# EAGLE design 12VSLA_UPS (EAGLE 6.4)
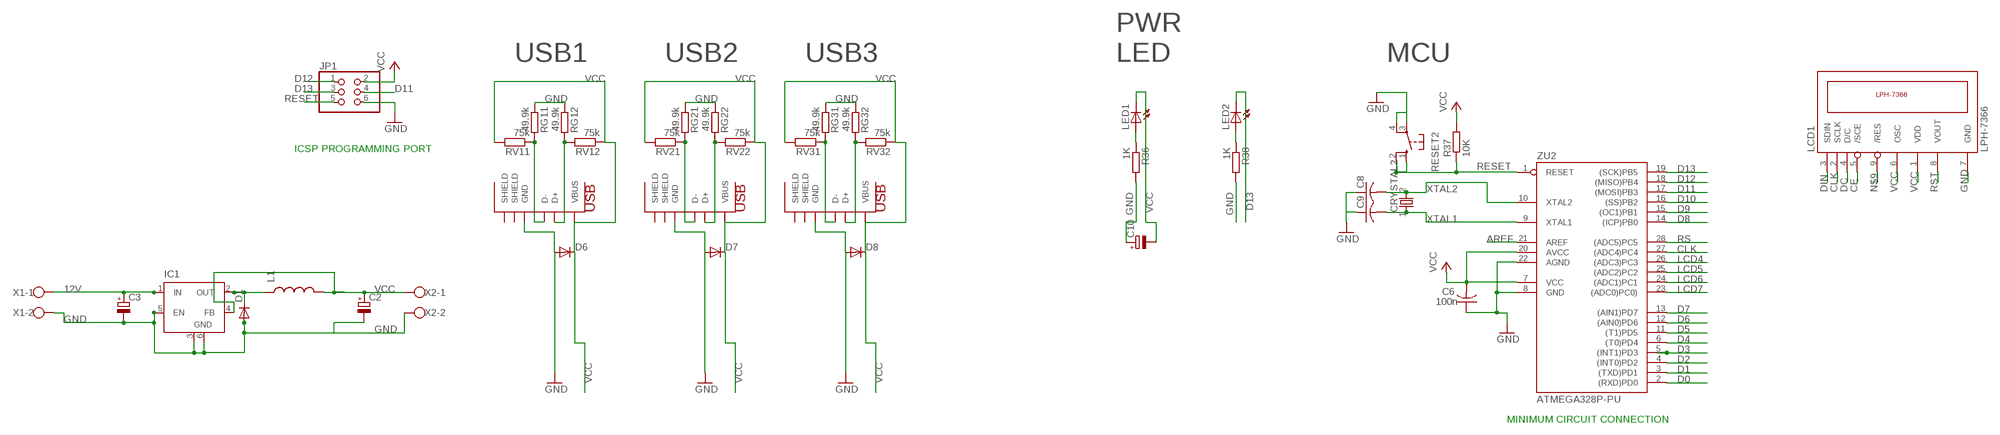
[diagram p0: schematic, sheet 1]

## Parts
C2  CPOL-EU153CLV-0605  [153CLV-0605]
C3  CPOL-EU153CLV-0605  [153CLV-0605]
C6  100n  C-USC1206K  [C1206K]
C8  C-USC1206K  [C1206K]
C9  C-USC1206K  [C1206K]
C10  CPOL-EU153CLV-0807  [153CLV-0807]
CRYSTAL2  CRYSTAL2PIN  [CRYSTAL-2PIN]
D1  DIODE-DO-214AC  [DO-214AC]
D6  DIODESMA-ALT  [SMA-DIODE_ALT]
D7  DIODESMA-ALT  [SMA-DIODE_ALT]
D8  DIODESMA-ALT  [SMA-DIODE_ALT]
IC1  LM2596S  [TO263-5]
JP1  PINHD-2X3  [2X03]
L1  INDUCTORPWR  [CDRH125]
LCD1  LPH-7366  [LPH-7366]
LED1  LED3MM  [LED3MM]
LED2  LED3MM  [LED3MM]
R36  1K  R-EU_M1206  [M1206]
R37  10K  R-EU_M1206  [M1206]
R38  1K  R-EU_M1206  [M1206]
RESET2  10-XX  [B3F-10XX]
RG11  49.9k  R-EU_M1206  [M1206]
RG12  49.9k  R-EU_M1206  [M1206]
RG21  49.9k  R-EU_M1206  [M1206]
RG22  49.9k  R-EU_M1206  [M1206]
RG31  49.9k  R-EU_M1206  [M1206]
RG32  49.9k  R-EU_M1206  [M1206]
RV11  75k  R-EU_M1206  [M1206]
RV12  75k  R-EU_M1206  [M1206]
RV21  75k  R-EU_M1206  [M1206]
RV22  75k  R-EU_M1206  [M1206]
RV31  75k  R-EU_M1206  [M1206]
RV32  75k  R-EU_M1206  [M1206]
USB1  USB-A-H  [USB-A-H]
USB2  USB-A-H  [USB-A-H]
USB3  USB-A-H  [USB-A-H]
X1  W237-102  [W237-102]
X2  W237-102  [W237-102]
ZU2  ATMEGA328P-PU  [DIL28-3]

## Nets
12V: C3.+ IC1.1(IN) X1.1
AREF [aref]: ZU2.21(AREF)
CE: LCD1.5(/SCE)
CLK: LCD1.2(SCLK) ZU2.27((ADC4)PC4)
D0: ZU2.2((RXD)PD0)
D1: ZU2.3((TXD)PD1)
D2: ZU2.4((INT0)PD2)
D3: ZU2.5((INT1)PD3)
D4: ZU2.6((T0)PD4)
D5: ZU2.11((T1)PD5)
D6: ZU2.12((AIN0)PD6)
D7: ZU2.13((AIN1)PD7)
D8: ZU2.14((ICP)PB0)
D9: ZU2.15((OC1)PB1)
D10: ZU2.16((SS)PB2)
D11: JP1.4 ZU2.17((MOSI)PB3)
D12: JP1.1 ZU2.18((MISO)PB4)
D13: JP1.3 LED2.K(C) ZU2.19((SCK)PB5)
D+4: RG12.2 RV12.2 USB1.D+
D+5: RG22.2 RV22.2 USB2.D+
D+6: RG32.2 RV32.2 USB3.D+
D-4: RG11.2 RV11.1 USB1.D-
D-5: RG21.2 RV21.1 USB2.D-
D-6: RG31.2 RV31.1 USB3.D-
DC: LCD1.4(D/C)
DIN: LCD1.3(SDIN)
GND: C2.- C3.- C6.1 C8.1 C9.1 C10.+ D1.2(A) D6.A D7.A D8.A IC1.3(GND) IC1.5(EN) IC1.6(GND) JP1.6 LCD1.7(GND) R36.2 R38.2 RESET2.3(P) RESET2.4(P1) RG11.1 RG12.1 RG21.1 RG22.1 RG31.1 RG32.1 USB1.GND USB2.GND USB3.GND X1.2 X2.2 ZU2.8(GND) ZU2.22(AGND)
LCD4: ZU2.26((ADC3)PC3)
LCD5: ZU2.25((ADC2)PC2)
LCD6: ZU2.24((ADC1)PC1)
LCD7: ZU2.23((ADC0)PC0))
N$1: D1.1(C) IC1.2(OUT) L1.1
N$2: LED1.A R36.1
N$3: LED2.A R38.1
N$9: LCD1.9(/RES)
RESET: JP1.5 R37.1 RESET2.1(S) RESET2.2(S1) ZU2.1(RESET)
RS: ZU2.28((ADC5)PC5)
RST: LCD1.8(VOUT)
VCC: C2.+ C6.2 C10.- D6.C D7.C D8.C IC1.4(FB) JP1.2 L1.2 LCD1.1(VDD) LCD1.6(OSC) LED1.K(C) R37.2 RV11.2 RV12.1 RV21.2 RV22.1 RV31.2 RV32.1 USB1.VBUS USB2.VBUS USB3.VBUS X2.1 ZU2.7(VCC) ZU2.20(AVCC)
XTAL1: C9.2 CRYSTAL2.1 ZU2.9(XTAL1)
XTAL2: C8.2 CRYSTAL2.2 ZU2.10(XTAL2)
Unconnected: USB1.GND@1(SHIELD) USB1.GND@2(SHIELD) USB2.GND@1(SHIELD) USB2.GND@2(SHIELD) USB3.GND@1(SHIELD) USB3.GND@2(SHIELD)

## Notes on the sheet
- USB1 | USB2 | USB3
- PWR
  LED
- MCU
- ICSP PROGRAMMING PORT
- MINIMUM CIRCUIT CONNECTION

## Library data of the parts
C2 C3 C10 = rcl:CPOL-EU: POLARIZED CAPACITOR, European symbol
C6 C8 C9 = adafruit:C-US: CAPACITOR, American symbol
CRYSTAL2 = BaseApp:CRYSTAL: CRYSTAL SMD-10.5X4.8-2PIN :- http://www.digikey.com/product-detail/en/CX49GFNB12000H0PESZZ/478-4349-1-ND/1532102 SMD-5X3- 4PIN :- 535-11281-1-ND
D1 = dp_devices:DIODE: Various Diode Packages
D6-D8 = SparkFun-DiscreteSemi:DIODE: Diode These are standard reverse protection diodes and small signal diodes. SMA package can handle up to about 1A. SOD-323 can handle about 200mA. What the SOD-323 package when ordering, there are some mfgs out there that are 5-pin packages.
IC1 = linear:LM2596S: STEP-DOWN VOLTAGE REGULATOR
JP1 = pinhead:PINHD-2X3: PIN HEADER
L1 = SparkFun-Passives:INDUCTOR: Inductors Basic Inductor/Choke - 0603 and 1206. Footprints are not proven and vary greatly between part numbers. SRN6045- 33uH, 20% 1.4A SDR0403-560KL - 56uH, 10%, 500mA RMS/740mA peak
LCD1 = lph-7366:LPH-7366
LED1 LED2 = adafruit:LED: LED OSRAM: - CHIPLED LG R971, LG N971, LY N971, LG Q971, LY Q971, LO R971, LY R971 LH N974, LH R974 LS Q976, LO Q976, LY Q976 LO Q996 - Hyper CHIPLED LW Q18S LB Q993, LB Q99A, LB R99A - SideLED LS A670, LO A670, LY A670, LG A670, LP A670 LB A673, LV A673, LT A673, LW A673 LH A674 LY A675 LS A676, LA A676, LO A676, LY A676, LW A676 LS A679, LY A679, LG A679 - Hyper Micro SIDELED® LS Y876, LA Y876, LO Y876, LY Y876 LT Y87S - SmartLED LW L88C, LW L88S LB L89C, LB L89S, LG L890 LS L89K, LO L89K, LY L89K LS L896, LA L896, LO L896, LY L896 - TOPLED LS T670, LO T670, LY T670, LG T670, LP T670 LSG T670, LSP T670, LSY T670, LOP T670, LYG T670 LG T671, LOG T671, LSG T671 LB T673, LV T673, LT T673, LW T673 LH T674 LS T676, LA T676, LO T676, LY T676, LB T676, LH T676, LSB T676, LW T676 LB T67C, LV T67C, LT T67C, LS T67K, LO T67K, LY T67K, LW E67C LS E67B, LA E67B, LO E67B, LY E67B, LB E67C, LV E67C, LT E67C LW T67C LS T679, LY T679, LG T679 LS T770, LO T770, LY T770, LG T770, LP T770 LB T773, LV T773, LT T773, LW T773 LH T774 LS E675, LA E675, LY E675, LS T675 LS T776, LA T776, LO T776, LY T776, LB T776 LHGB T686 LT T68C, LB T68C - Hyper Mini TOPLED® LB M676 - Mini TOPLED Santana® LG M470 LS M47K, LO M47K, LY M47K Source: http://www.osram.convergy.de/
R36 R38 RG11 RG12 RG21 RG22 RG31 RG32 RV11 RV12 RV21 RV22 RV31 RV32 = resistor:R-EU_: RESISTOR, European symbol
R37 = rcl:R-EU_: RESISTOR, European symbol
RESET2 = switch-omron:10-XX: OMRON SWITCH; MPN: B3F-1000; OC_FARNELL: 176432; OC_NEWARK: 36M3542
USB1-USB3 = BaseApp:USB
X1 X2 = con-wago-500:W237-102: WAGO SCREW CLAMP; MPN: 237-102; OC_FARNELL: unknown; OC_NEWARK: 70K9898
ZU2 = SmartPrj:ATMEGA328P-: MICROCONTROLLER 4 Kbytes FLASH 128 bytes SRAM 256 bytes EEPROM UART 6-channel 10 bit ADC

## Net classes
0 default: width 0.254 mm, clearance 0.254 mm
4 aref: width 0.406 mm, drill 0.61 mm, clearance 0.254 mm

## Board
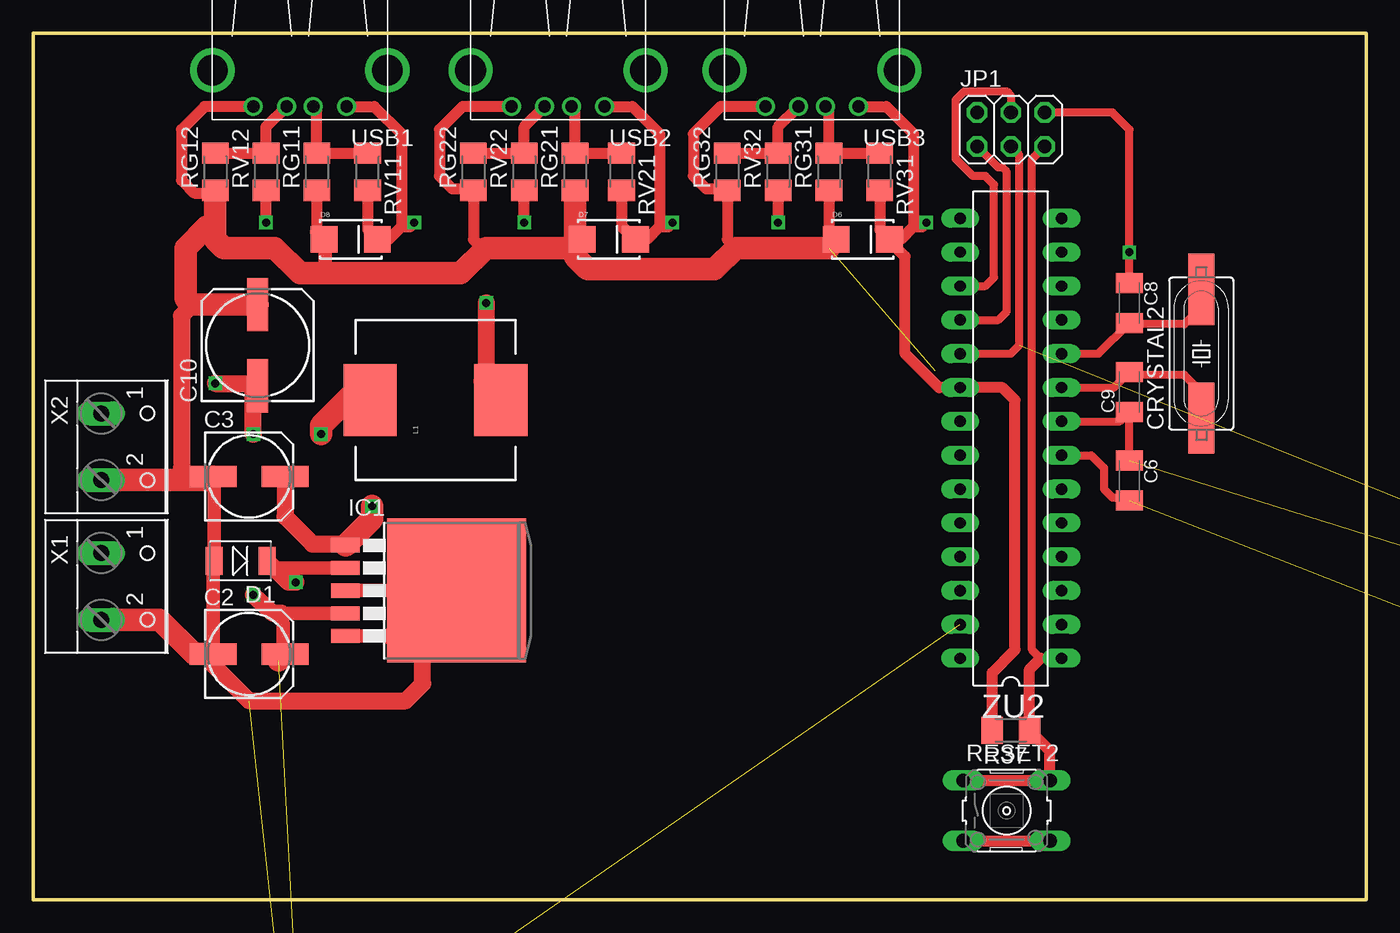
[diagram p1: board, top side]
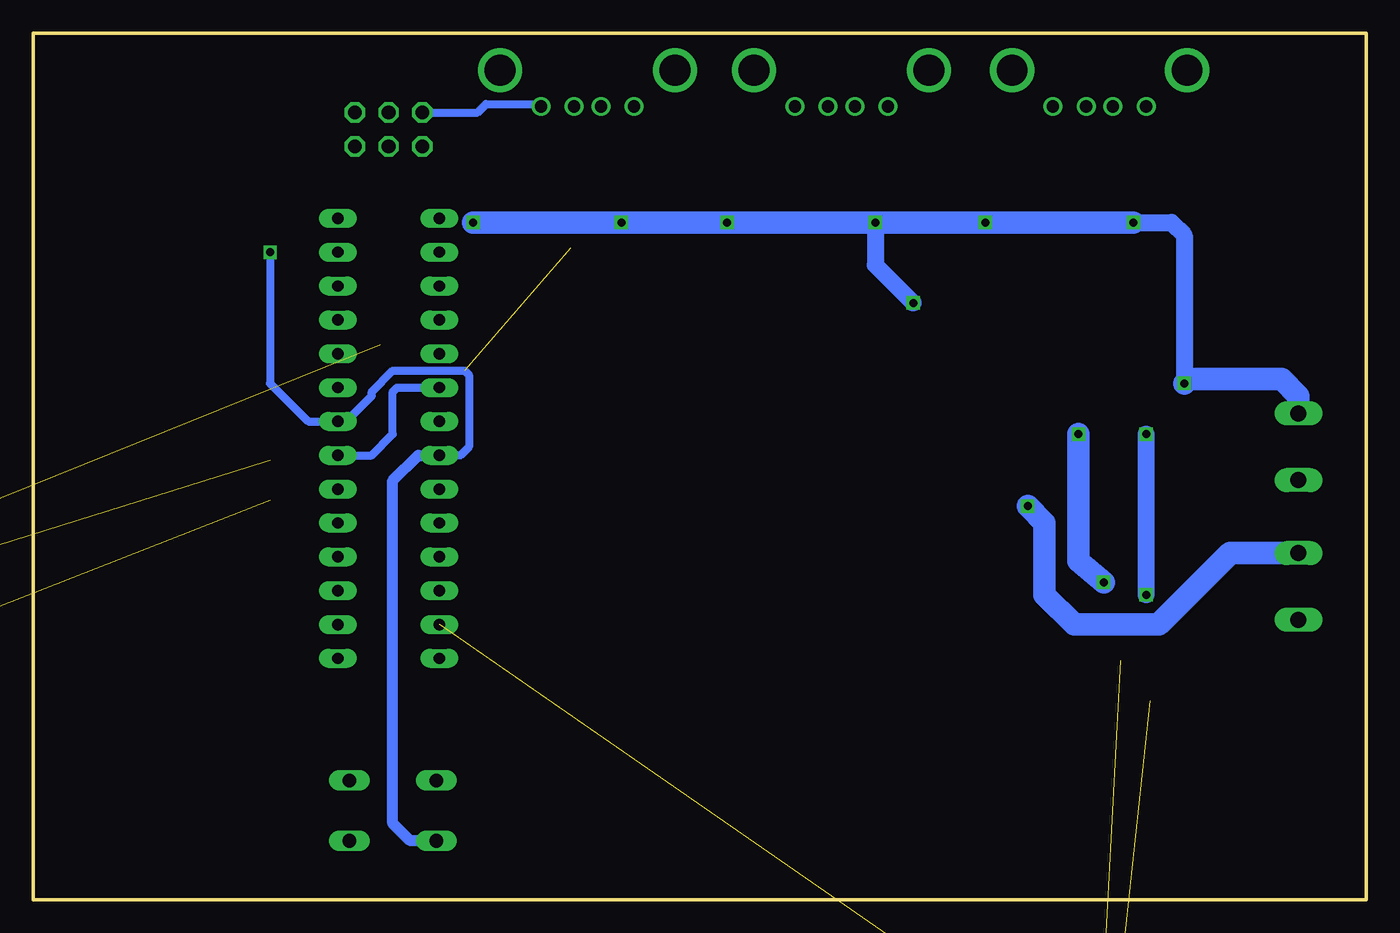
[diagram p2: board, bottom side, seen from below]

Size 100 x 65 mm. Coordinates in mm from the lower left corner, seen from the top.
Outline: 0,65 0,0 100,0 100,65 0,65
Copper layers (1*16): Top 0.035mm / dielectric 1.5mm / Bottom 0.035mm
Design rules "default": minimum track width 10mil, minimum drill 24mil, track to track 8mil, track to pad 8mil, pad to pad 8mil, via to via 8mil, smd to smd 8mil, copper to edge 40mil, drill to drill 8mil, minimum pad ring 10mil, minimum via ring 8mil, stop-mask expansion 4mil, vias tented up to drill 0mil, thermal gap 10mil

### Footprints (pad centres in the part's own frame; a part is rotated, then mirrored left to right if it is on the bottom)
153CLV-0605 = smd 3.5 x 1.6: + 2.7,0; - -2.7,0
C1206K = smd 1.5 x 2: 1 -1.5,0; 2 1.5,0
153CLV-0807 = smd 4 x 1.6: + 3.05,0; - -3.05,0
CRYSTAL-2PIN = smd 5.334 x 1.93: 1 -4.826,0; 2 4.826,0
DO-214AC = smd 1.27 x 2.1: 1 -1.98,0; 2 1.98,0
SMA-DIODE_ALT = smd 2 x 2: A -2,0; C 2,0
TO263-5 = smd 1.067 x 2.159: 1 -3.404,-5.791; 2 -1.702,-5.791; 3 0,-5.791; 4 1.702,-5.791; 5 3.404,-5.791 | smd 10.8 x 10.41: 6 0,2.54
2X03 = drill 1.016 octagon: 1 -2.54,-1.27; 2 -2.54,1.27; 3 0,-1.27; 4 0,1.27; 5 2.54,-1.27; 6 2.54,1.27
CDRH125 = smd 5.4 x 4: 1 0,4.9; 2 0,-4.9
LPH-7366 = smd 0.75 x 4: 1 4,17; 2 3,17; 3 2,17; 4 1,17; 5 0,17; 6 -1,17; 7 -2,17; 8 -3,17; 9 -4,17 | hole 1.5: -17,13; 17,-12.5
LED3MM = drill 0.813 pad 1.676 octagon: A -1.27,0; K 1.27,0
M1206 = smd 1.6 x 2: 1 -1.4,0; 2 1.4,0
B3F-10XX = drill 1.016 long: 1 -3.251,2.261; 2 3.251,2.261; 3 -3.251,-2.261; 4 3.251,-2.261
USB-A-H = drill 0.914: D+ 3.988,-1.003; D- 3.988,1.003; GND 3.988,-3.493; VBUS 3.988,3.493 | drill 2.311: GND@1 1.27,6.566; GND@2 1.27,-6.566
W237-102 = drill 1.194 long: 1 -2.5,-1.27; 2 2.5,-1.27
DIL28-3 = drill 0.85 pad 1.422 long: 1 -16.51,-3.81; 2 -13.97,-3.81; 3 -11.43,-3.81; 4 -8.89,-3.81; 5 -6.35,-3.81; 6 -3.81,-3.81; 7 -1.27,-3.81; 8 1.27,-3.81; 9 3.81,-3.81; 10 6.35,-3.81; 11 8.89,-3.81; 12 11.43,-3.81; 13 13.97,-3.81; 14 16.51,-3.81; 15 16.51,3.81; 16 13.97,3.81; 17 11.43,3.81; 18 8.89,3.81; 19 6.35,3.81; 20 3.81,3.81; 21 1.27,3.81; 22 -1.27,3.81; 23 -3.81,3.81; 24 -6.35,3.81; 25 -8.89,3.81; 26 -11.43,3.81; 27 -13.97,3.81; 28 -16.51,3.81

### Placement (x,y rotation side)
C2  16.19,18.41 0 top
C3  16.19,31.75 0 top
C6  82.23,31.43 270 top
C8  82.23,44.77 270 top
C9  82.23,38.1 90 top
C10  16.83,41.59 90 top
CRYSTAL2  87.63,40.96 90 top
D1  15.56,25.4 180 top
D6  62.23,49.53 0 top
D7  43.18,49.53 0 top
D8  23.81,49.53 0 top
IC1  29.21,23.18 270 top
JP1  73.34,57.78 0 top
L1  30.16,37.47 90 top
LCD1  20.95,-27.94 0 top  (outside the outline)
LED1  170.5,-4.13 180 top  (outside the outline)
LED2  170.5,3.17 180 top  (outside the outline)
R36  176.21,-4.13 0 top  (outside the outline)
R37  73.34,12.7 180 top
R38  176.21,3.17 0 top  (outside the outline)
RESET2  73.03,6.67 0 top
RG11  21.27,54.61 90 top
RG12  13.65,54.61 90 top
RG21  40.64,54.61 90 top
RG22  33.02,54.61 90 top
RG31  59.69,54.61 90 top
RG32  52.07,54.61 90 top
RV11  25.08,54.61 270 top
RV12  17.46,54.61 90 top
RV21  44.13,54.61 270 top
RV22  36.83,54.61 90 top
RV31  63.5,54.61 270 top
RV32  55.88,54.61 90 top
USB1  20,63.5 270 top
USB2  39.37,63.5 270 top
USB3  58.42,63.5 270 top
X1  6.35,23.5 270 top
X2  6.35,33.97 270 top
ZU2  73.34,34.61 90 top

### Tracks (layer width: path | path; a pad name or v marks a point on that pad's centre or on a via)
12V  (via drill 0.6)
  Top 1.27: C3.+ 18.89,28.73 20.95,26.67 23.33,26.67 IC1.1
  Top 1.676: v25.4,29.53 25.4,28.56 IC1.1
  Bottom 1.676: X1.1 10.2,26 15.56,20.64 21.91,20.64 24.13,22.86 24.13,28.26 v25.4,29.53
CLK  (1 unrouted)
D11
  Top 0.61: ZU2.17 71.44,46.04 72.07,46.67 72.07,53.66 71.44,54.29 70.48,54.29 69.22,55.56 69.22,60.01 69.85,60.64 73.03,60.64 73.34,60.33 JP1.4
D12
  Top 0.61: ZU2.18 72.39,43.5 73.03,44.13 73.03,54.61 72.71,54.93 72.39,54.93 JP1.1
D13  (1 unrouted)
  Top 0.61: ZU2.19 73.34,40.96 73.98,41.59 73.98,55.88 JP1.3
D+4
  Top 0.813: USB1.D+ 17.46,57.98 RV12.2 RG12.2
D+5
  Top 0.813: USB2.D+ 36.83,57.98 RV22.2 RG22.2
D+6
  Top 0.813: USB3.D+ 55.88,57.98 RV32.2 RG32.2
D-4
  Top 0.813: RV11.1 RG11.2 21.27,59.24 USB1.D-
D-5
  Top 0.813: USB2.D- 40.64,59.24 RG21.2 RV21.1
D-6
  Top 0.813: USB3.D- 59.69,59.24 RG31.2 RV31.1
GND  (via drill 0.6)  (4 unrouted)
  Top 0.61: C6.1 C9.1 81.51,35.88 ZU2.8 | C8.1 v82.23,48.58 82.23,57.78 80.96,59.05 JP1.6
  Top 0.813: USB1.GND 12.84,59.51 11.11,57.78 11.11,53.98 12.06,53.02 13.46,53.02 RG12.1 | USB2.GND 32.21,59.51 30.48,57.78 30.48,54.29 31.43,53.34 32.89,53.34 RG22.1 33.02,49.53 33.66,48.9 33.97,48.9 | USB3.GND 51.58,59.51 49.53,57.47 49.53,54.29 50.48,53.34 51.94,53.34 RG32.1 52.07,49.53 52.7,48.9 | RG11.1 21.27,50.07 | RG21.1 40.64,50.07 40.75,49.96 | 40.75,49.96 D7.A | RG31.1 59.69,50.07 59.8,49.96 | 59.8,49.96 D6.A | 59.69,48.9 59.8,49.96 | 40.01,48.9 40.75,49.96 | RESET2.3 RESET2.4
  Top 1.016: IC1.6 30.16,23.18 | 30.16,23.18 IC1.3 | IC1.5 26.76,19.77 30.16,23.18 | C2.- 13.49,25.32 D1.2 13.58,31.66 C3.- | 21.91,46.99 21.91,49.44 D8.A 21.27,50.07
  Top 1.27: 26.76,19.77 28.8,19.77 29.21,19.37 29.21,16.19 27.94,14.92 16.19,14.92 13.49,17.62 C2.- | 13.65,31.91 C3.- 11.75,31.75 11.11,32.38 11.11,43.81 11.94,44.64 C10.+
  Top 1.676: 59.69,48.9 52.7,48.9 51.12,47.31 41.59,47.31 40.64,48.26 RG21.1 | 40.01,48.9 33.97,48.9 32.07,46.99 21.91,46.99 20,46.99 18.1,48.9 14.29,48.9 13.65,49.53 13.65,50.48 | RG12.1 13.65,50.48 | C10.+ 11.87,44.64 11.43,45.09 11.43,48.9 13.02,50.48 13.65,50.48 | X1.2 9.48,21 12.06,18.41 C2.- | X2.2 13.21,31.47 C3.-
  Bottom 0.61: v82.23,48.58 82.23,38.73 79.38,35.88 ZU2.8 76.52,35.88 74.61,37.78 74.61,38.1 73.03,39.69 67.63,39.69 67.31,39.37 67.31,33.97 67.94,33.34 ZU2.22
  Bottom 0.813: RESET2.3 71.72,4.41 73.03,5.71 73.03,31.43 71.12,33.34 ZU2.22
N$1  (via drill 0.6)
  Top 1.016: IC1.2 18.06,24.88 D1.1
  Top 1.27: v19.68,23.81 19.12,23.81 D1.1
  Top 1.676: L1.1 23.81,37.78 21.59,35.56 v21.59,34.92
  Bottom 1.676: v21.59,34.92 21.59,25.4 v19.68,23.81
N$2  (1 unrouted)
N$3  (1 unrouted)
RESET
  Top 0.61: ZU2.1 75.56,18.1 74.93,18.73 74.93,55.56 JP1.5
  Top 0.813: 75.56,18.1 74.74,17.27 R37.1 76.28,11.17 RESET2.2 RESET2.1
VCC  (via drill 0.6)  (3 unrouted)
  Top 0.61: ZU2.7 79.38,33.34 80.33,32.38 80.33,30.8 80.96,30.16 82,30.16 C6.2
  Top 0.813: USB3.VBUS 63.99,59.51 66.04,57.47 66.04,50.48 | 66.04,50.48 65.09,49.53 64.77,49.53 | 64.77,49.53 D6.C 63.5,50.26 RV31.2 | USB2.VBUS 44.95,59.51 46.99,57.47 46.99,50.48 | 46.99,50.48 46.04,49.53 D7.C 44.13,50.58 RV21.2 44.13,50.48 44.45,50.16 | USB1.VBUS 25.58,59.51 27.62,57.47 27.62,50.48 | RV11.2 25.08,50.26 D8.C 26.67,49.53 27.62,50.48 | RV32.1 v55.88,50.8 | v36.83,50.8 RV22.1 | v17.46,50.8 RV12.1 | 46.99,50.48 47.62,50.48 v47.94,50.8 | 66.04,50.48 66.67,50.48 v66.99,50.8 | 27.62,50.48 28.26,50.48 v28.57,50.8 | R37.2 71.94,17.02 73.66,18.73 73.66,37.47 72.71,38.42 ZU2.20 67.94,38.42 65.41,40.96 65.41,48.26 64.77,48.9 64.77,49.53
  Top 1.016: IC1.4 18.62,21.48 18.73,20.64 18.73,18.57 C2.+
  Top 1.27: 33.66,38.87 33.97,38.55 | 33.97,38.55 L1.2 | v13.65,38.73 16.64,38.73 C10.- 16.51,38.23 v16.51,34.92 | v33.97,44.77 33.97,38.55 | 18.62,21.48 17.98,21.48 v16.51,22.86
  Top 1.676: 18.41,17.94 C2.+
  Bottom 0.61: ZU2.7 74.61,33.34 73.03,34.92 73.03,38.1 72.71,38.42 ZU2.20 | JP1.2 66.67,59.05 66.04,59.69 62.09,59.69 USB3.VBUS
  Bottom 1.27: v17.46,50.8 14.61,50.8 13.65,49.85 v13.65,38.73 | v36.83,50.8 36.83,47.62 v33.97,44.77 | v16.51,22.86 v16.51,34.92
  Bottom 1.676: v66.99,50.8 v55.88,50.8 v47.94,50.8 v36.83,50.8 v28.57,50.8 v17.46,50.8 | X2.1 5.08,37.78 6.35,39.05 13.34,39.05 v13.65,38.73
XTAL1
  Top 0.61: ZU2.9 81.05,38.42 C9.2 82.46,39.37 86.36,39.37 87.63,38.1 CRYSTAL2.1
XTAL2
  Top 0.61: ZU2.10 79.92,40.96 C8.2 82.32,43.18 86.36,43.18 87.63,44.45 CRYSTAL2.2